# EAGLE design Ver.5 MAIN (EAGLE 9.6.2)
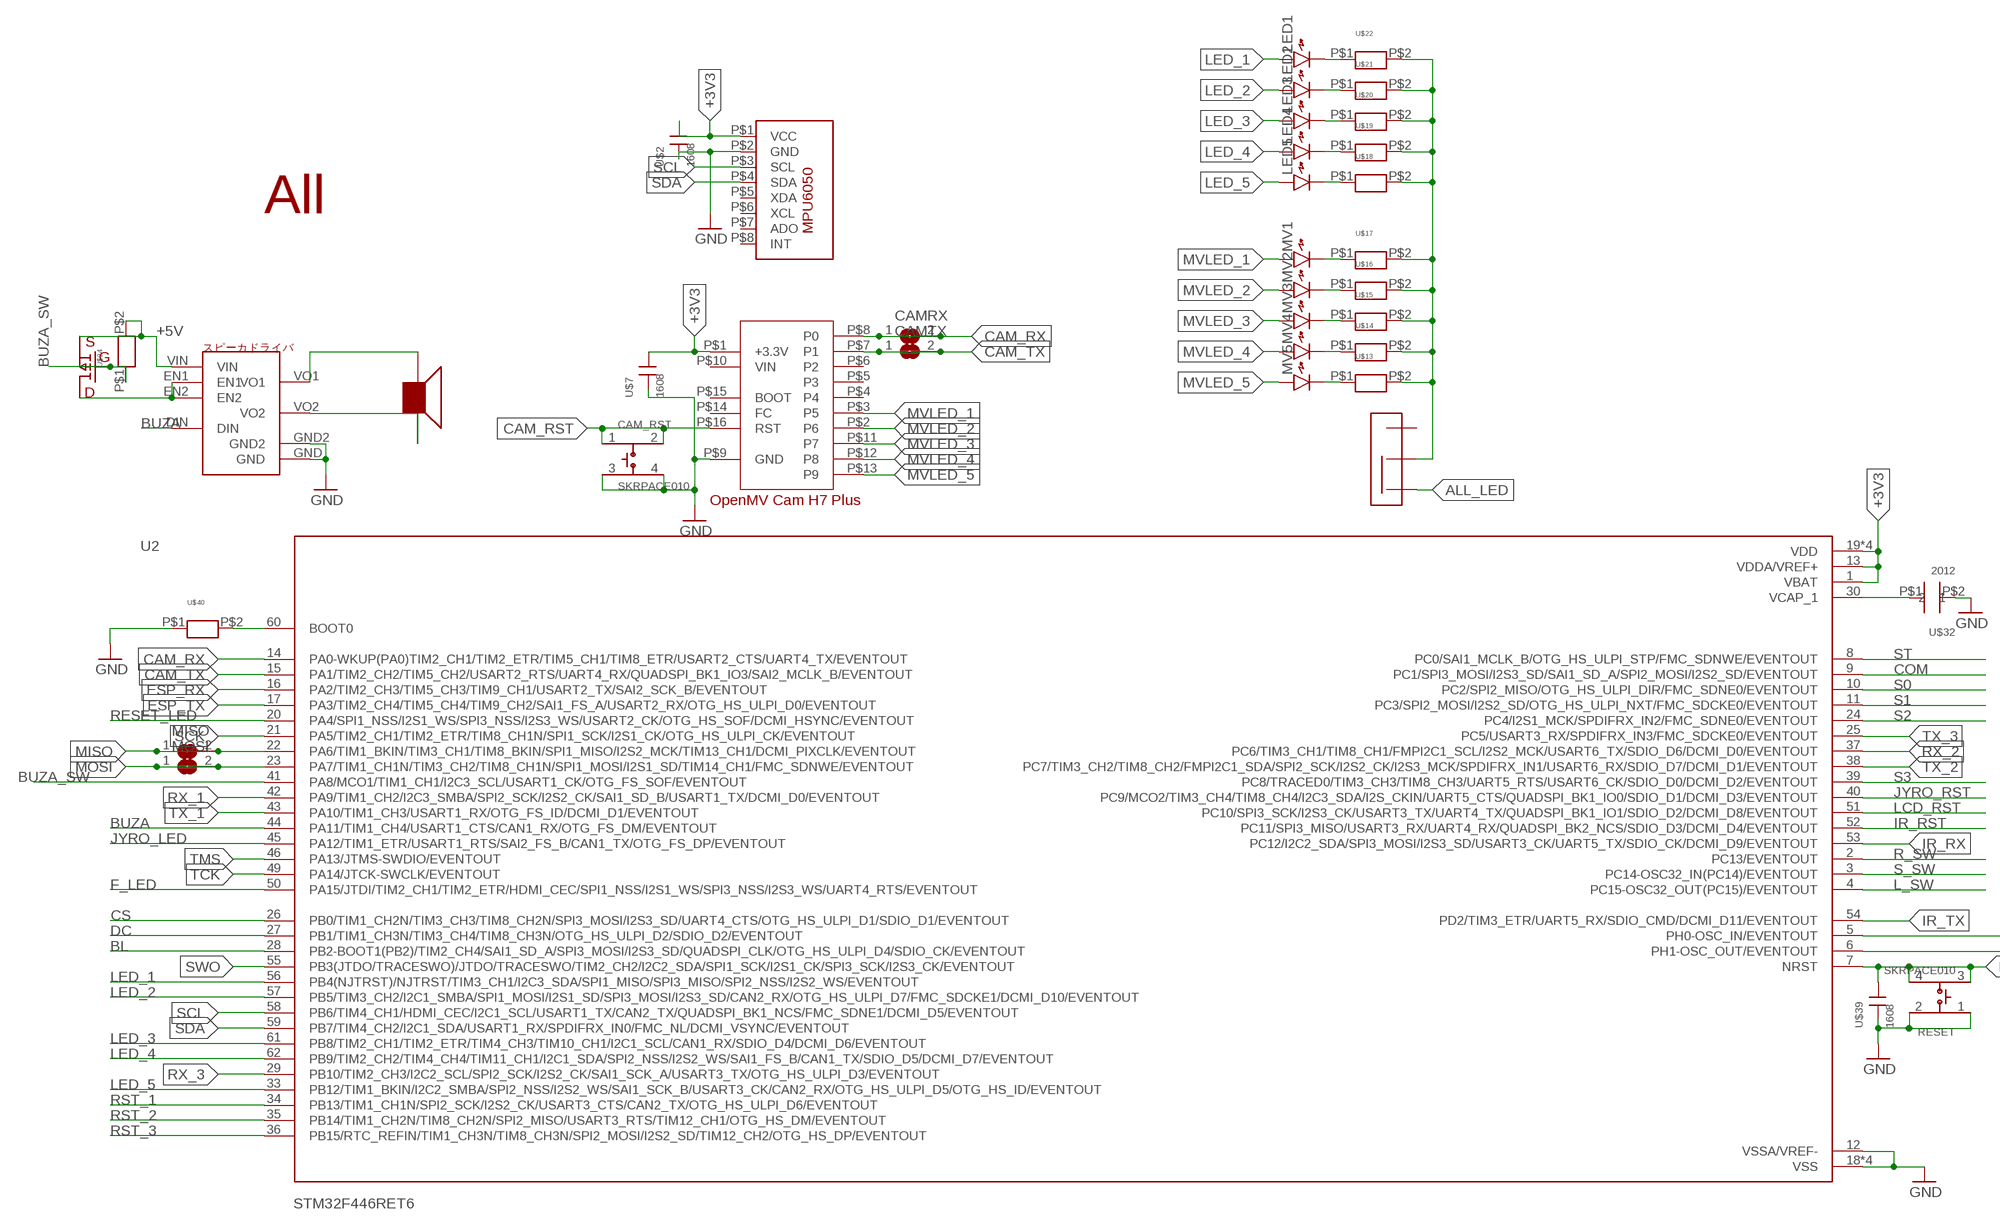
[diagram p0: schematic, sheet 1, part 1 of 2]
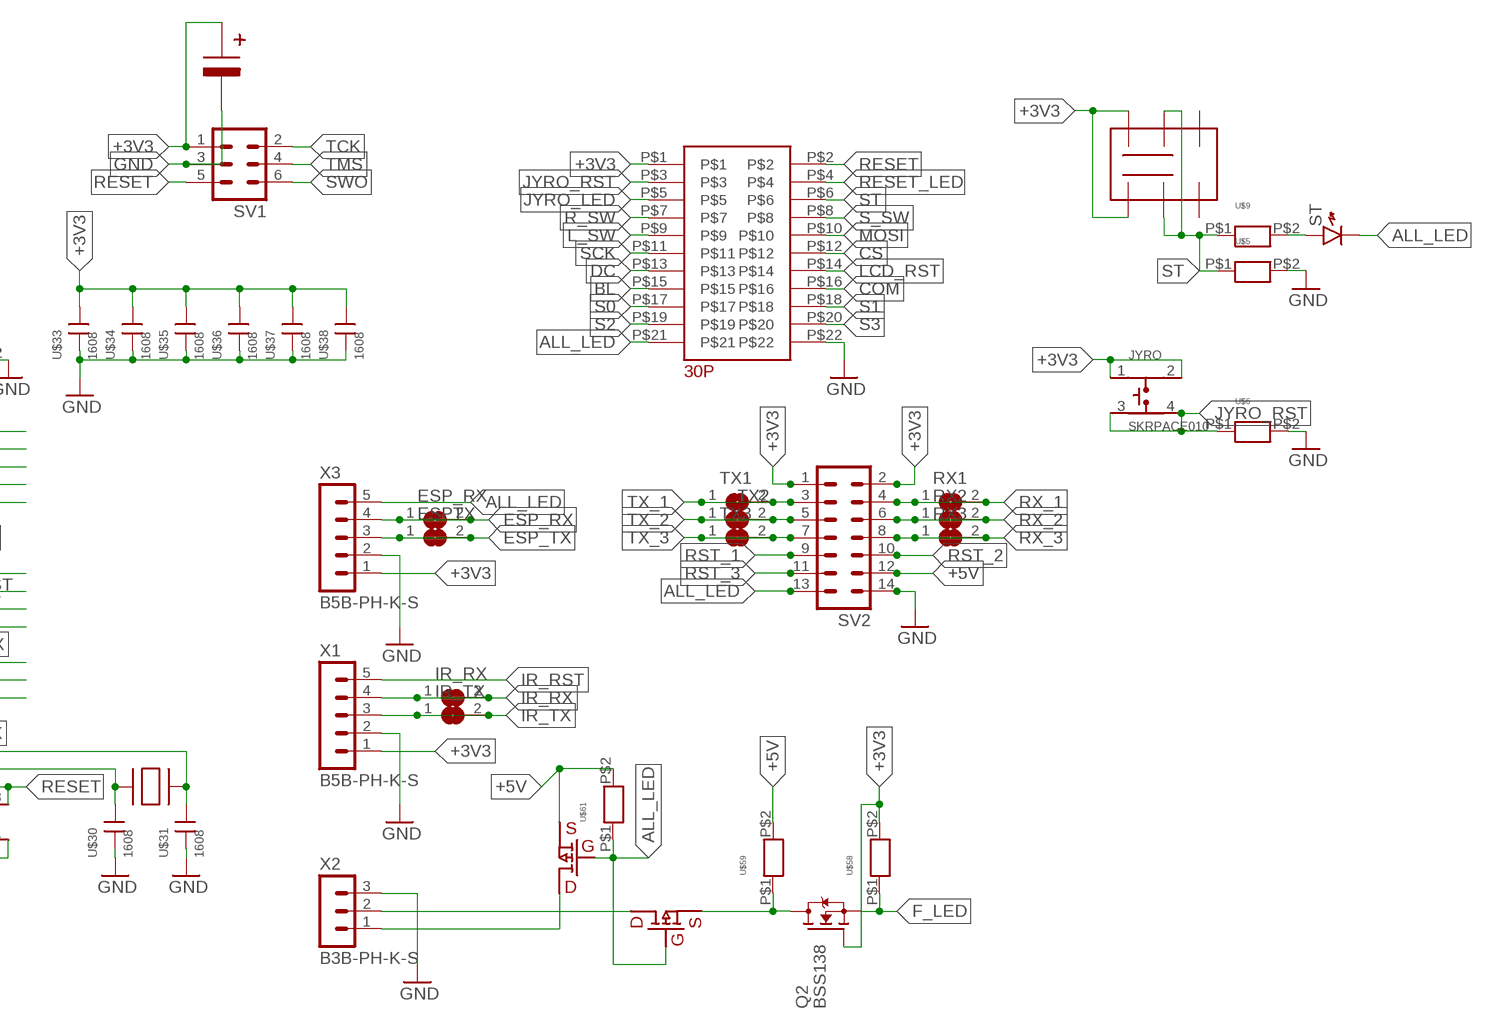
[diagram p1: schematic, sheet 1, part 2 of 2]

## Parts
CAM_RST  SKRPACE010  [SW_SKRPACE010]
CAMRX  SJ  [SJ]
CAMTX  SJ  [SJ]
ESP_RX  SJ  [SJ]
ESPTX  SJ  [SJ]
IR_RX  SJ  [SJ]
IR_TX  SJ  [SJ]
JYRO  SKRPACE010  [SW_SKRPACE010]
LED1  LED1608  [LED1608]
LED2  LED1608  [LED1608]
LED3  LED1608  [LED1608]
LED4  LED1608  [LED1608]
LED5  LED1608  [LED1608]
MISO  SJ  [SJ]
MOSI  SJ  [SJ]
MV1  LED1608  [LED1608]
MV2  LED1608  [LED1608]
MV3  LED1608  [LED1608]
MV4  LED1608  [LED1608]
MV5  LED1608  [LED1608]
Q2  BSS138  [SOT23]
RESET  SKRPACE010  [SW_SKRPACE010]
RX1  SJ  [SJ]
RX2  SJ  [SJ]
RX3  SJ  [SJ]
ST  LED1608  [LED1608]
SV1  ML6L  [ML6L]
SV2  ML14L  [ML14L]
TX1  SJ  [SJ]
TX2  SJ  [SJ]
TX3  SJ  [SJ]
U2  STM32F446RET6  [QFP50P1200X1200X160-64N]
U$1  OPENMV  [OPENMV]
U$2  1608  [CON]
U$3  ジャイロ  [ジャイロ]
U$4  LPRP  [LPRO]
U$5  R  [1608]
U$6  R  [1608]
U$7  1608  [CON]
U$8  22SW  [２２ｓｗ]
U$9  R  [1608]
U$10  SSW  [SSW]
U$11  BUZA_DR  [BUZA_DR]
U$12  BUZA-  [ぶざー]
U$13  R  [1608]
U$14  R  [1608]
U$15  R  [1608]
U$16  R  [1608]
U$17  R  [1608]
U$18  R  [1608]
U$19  R  [1608]
U$20  R  [1608]
U$21  R  [1608]
U$22  R  [1608]
U$23  808  [808]
U$24  R  [1608]
U$25  10  [10]
U$26  ALL  [ALL]
U$29  SUISYOU  [水晶]
U$30  1608  [CON]
U$31  1608  [CON]
U$32  2012  [2012]
U$33  1608  [CON]
U$34  1608  [CON]
U$35  1608  [CON]
U$36  1608  [CON]
U$37  1608  [CON]
U$38  1608  [CON]
U$39  1608  [CON]
U$40  R  [1608]
U$58  R  [1608]
U$59  R  [1608]
U$60  808  [808]
U$61  R  [1608]
U$62  808  [808]
X1  B5B-PH-K-S  [B5B-PH-K-S]
X2  B3B-PH-K-S  [B3B-PH-K-S]
X3  B5B-PH-K-S  [B5B-PH-K-S]

## Nets
+3V3 [New Class]: JYRO.1 JYRO.2 Q2.1(G) SV1.1 SV2.1 SV2.2 U2.1(VBAT) U2.13(VDDA/VREF+) U2.19(VDD) U2.32(VDD) U2.48(VDD) U2.64(VDD) U$1.P$1(+3.3V) U$2.P$1 U$3.P$1(VCC) U$4.P$1 U$7.P$1 U$8.P$1 U$8.P$4 U$25.P$1 U$33.P$1 U$34.P$1 U$35.P$1 U$36.P$1 U$37.P$1 U$38.P$1 U$58.P$2 X1.1 X3.1
+5V [New Class]: SV2.12 U$11.VIN U$23.S U$24.P$2 U$59.P$2 U$60.S U$61.P$2
+5V_OFF1 [New Class]: U$60.D U$60.DD(D) U$60.DDD(D) U$60.DDDD(D) X2.1
ALL_LED [New Class]: ST.K SV2.13 U$4.P$21 U$10.P$1 U$60.G U$61.P$1 U$62.G X3.5
BL: U2.28(PB2-BOOT1(PB2)/TIM2_CH4/SAI1_SD_A/SPI3_MOSI/I2S3_SD/QUADSPI_CLK/OTG_HS_ULPI_D4/SDIO_CK/EVENTOUT) U$4.P$15
BUZA: U2.44(PA11/TIM1_CH4/USART1_CTS/CAN1_RX/OTG_FS_DM/EVENTOUT) U$11.DIN
BUZA_SW: U2.41(PA8/MCO1/TIM1_CH1/I2C3_SCL/USART1_CK/OTG_FS_SOF/EVENTOUT) U$23.G U$24.P$1
CAM_RST: CAM_RST.1 CAM_RST.2 U$1.P$16(RST)
CAM_RX: CAMRX.1 CAMRX.2 U2.14(PA0-WKUP(PA0)TIM2_CH1/TIM2_ETR/TIM5_CH1/TIM8_ETR/USART2_CTS/UART4_TX/EVENTOUT) U$1.P$8(P0)
CAM_TX: CAMTX.1 CAMTX.2 U2.15(PA1/TIM2_CH2/TIM5_CH2/USART2_RTS/UART4_RX/QUADSPI_BK1_IO3/SAI2_MCLK_B/EVENTOUT) U$1.P$7(P1)
COM: U2.9(PC1/SPI3_MOSI/I2S3_SD/SAI1_SD_A/SPI2_MOSI/I2S2_SD/EVENTOUT) U$4.P$16
CS: U2.26(PB0/TIM1_CH2N/TIM3_CH3/TIM8_CH2N/SPI3_MOSI/I2S3_SD/UART4_CTS/OTG_HS_ULPI_D1/SDIO_D1/EVENTOUT) U$4.P$12
DC: U2.27(PB1/TIM1_CH3N/TIM3_CH4/TIM8_CH3N/OTG_HS_ULPI_D2/SDIO_D2/EVENTOUT) U$4.P$13
ESP_RX: ESP_RX.1 ESP_RX.2 U2.16(PA2/TIM2_CH3/TIM5_CH3/TIM9_CH1/USART2_TX/SAI2_SCK_B/EVENTOUT) X3.4
ESP_TX: ESPTX.1 ESPTX.2 U2.17(PA3/TIM2_CH4/TIM5_CH4/TIM9_CH2/SAI1_FS_A/USART2_RX/OTG_HS_ULPI_D0/EVENTOUT) X3.3
F_LED: Q2.2(S) U2.50(PA15/JTDI/TIM2_CH1/TIM2_ETR/HDMI_CEC/SPI1_NSS/I2S1_WS/SPI3_NSS/I2S3_WS/UART4_RTS/EVENTOUT) U$58.P$1
GND [New Class]: CAM_RST.3 CAM_RST.4 RESET.1 RESET.2 SV1.3 SV2.14 U2.12(VSSA/VREF-) U2.18(VSS) U2.31(VSS) U2.47(VSS) U2.63(VSS) U$1.P$9(GND) U$2.P$2 U$3.P$2(GND) U$4.P$22 U$5.P$2 U$6.P$2 U$7.P$2 U$11.GND U$11.GND2 U$25.P$2 U$30.P$2 U$31.P$2 U$32.P$2 U$33.P$2 U$34.P$2 U$35.P$2 U$36.P$2 U$37.P$2 U$38.P$2 U$39.P$2 U$40.P$1 X1.2 X2.3 X3.2
IR_RST: U2.52(PC11/SPI3_MISO/USART3_RX/UART4_RX/QUADSPI_BK2_NCS/SDIO_D3/DCMI_D4/EVENTOUT) X1.5
IR_RX: IR_RX.1 IR_RX.2 U2.53(PC12/I2C2_SDA/SPI3_MOSI/I2S3_SD/USART3_CK/UART5_TX/SDIO_CK/DCMI_D9/EVENTOUT) X1.4
IR_TX: IR_TX.1 IR_TX.2 U2.54(PD2/TIM3_ETR/UART5_RX/SDIO_CMD/DCMI_D11/EVENTOUT) X1.3
JYRO_LED: U2.45(PA12/TIM1_ETR/USART1_RTS/SAI2_FS_B/CAN1_TX/OTG_FS_DP/EVENTOUT) U$4.P$5
JYRO_RST: JYRO.3 JYRO.4 U2.40(PC9/MCO2/TIM3_CH4/TIM8_CH4/I2C3_SDA/I2S_CKIN/UART5_CTS/QUADSPI_BK1_IO0/SDIO_D1/DCMI_D3/EVENTOUT) U$4.P$3 U$6.P$1
L_SW: U2.4(PC15-OSC32_OUT(PC15)/EVENTOUT) U$4.P$9
LCD_RST: U2.51(PC10/SPI3_SCK/I2S3_CK/USART3_TX/UART4_TX/QUADSPI_BK1_IO1/SDIO_D2/DCMI_D8/EVENTOUT) U$4.P$14
LED_1: LED1.A U2.56(PB4(NJTRST)/NJTRST/TIM3_CH1/I2C3_SDA/SPI1_MISO/SPI3_MISO/SPI2_NSS/I2S2_WS/EVENTOUT)
LED_2: LED2.A U2.57(PB5/TIM3_CH2/I2C1_SMBA/SPI1_MOSI/I2S1_SD/SPI3_MOSI/I2S3_SD/CAN2_RX/OTG_HS_ULPI_D7/FMC_SDCKE1/DCMI_D10/EVENTOUT)
LED_3: LED3.A U2.61(PB8/TIM2_CH1/TIM2_ETR/TIM4_CH3/TIM10_CH1/I2C1_SCL/CAN1_RX/SDIO_D4/DCMI_D6/EVENTOUT)
LED_4: LED4.A U2.62(PB9/TIM2_CH2/TIM4_CH4/TIM11_CH1/I2C1_SDA/SPI2_NSS/I2S2_WS/SAI1_FS_B/CAN1_TX/SDIO_D5/DCMI_D7/EVENTOUT)
LED_5: LED5.A U2.33(PB12/TIM1_BKIN/I2C2_SMBA/SPI2_NSS/I2S2_WS/SAI1_SCK_B/USART3_CK/CAN2_RX/OTG_HS_ULPI_D5/OTG_HS_ID/EVENTOUT)
MISO: MISO.1 MISO.2 U2.22(PA6/TIM1_BKIN/TIM3_CH1/TIM8_BKIN/SPI1_MISO/I2S2_MCK/TIM13_CH1/DCMI_PIXCLK/EVENTOUT)
MOSI: MOSI.1 MOSI.2 U2.23(PA7/TIM1_CH1N/TIM3_CH2/TIM8_CH1N/SPI1_MOSI/I2S1_SD/TIM14_CH1/FMC_SDNWE/EVENTOUT) U$4.P$10
MVLED_1: MV1.A U$1.P$3(P5)
MVLED_2: MV2.A U$1.P$2(P6)
MVLED_3: MV3.A U$1.P$11(P7)
MVLED_4: MV4.A U$1.P$12(P8)
MVLED_5: MV5.A U$1.P$13(P9)
N$1: U$62.D U$62.DD(D) U$62.DDD(D) U$62.DDDD(D) X2.2
N$2: U$11.VO1 U$12.P$1
N$3: U$11.VO2 U$12.P$2
N$6: U$11.EN1 U$11.EN2 U$23.D U$23.DD(D) U$23.DDD(D) U$23.DDDD(D)
N$17: ST.A U$9.P$2
N$19: U$10.P$3 U$13.P$2 U$14.P$2 U$15.P$2 U$16.P$2 U$17.P$2 U$18.P$2 U$19.P$2 U$20.P$2 U$21.P$2 U$22.P$2
N$20: LED1.K U$22.P$1
N$21: LED2.K U$21.P$1
N$22: LED3.K U$20.P$1
N$23: LED4.K U$19.P$1
N$24: LED5.K U$18.P$1
N$25: MV5.K U$13.P$1
N$26: MV4.K U$14.P$1
N$27: MV3.K U$15.P$1
N$28: MV2.K U$16.P$1
N$29: MV1.K U$17.P$1
N$40: U2.6(PH1-OSC_OUT/EVENTOUT) U$29.P$1 U$30.P$1
N$41: U2.5(PH0-OSC_IN/EVENTOUT) U$29.P$2 U$31.P$1
N$42: Q2.3(D) U$59.P$1 U$62.S
N$43: U2.30(VCAP_1) U$32.P$1
N$44: U2.60(BOOT0) U$40.P$2
R_SW: U2.2(PC13/EVENTOUT) U$4.P$7
RESET: RESET.3 RESET.4 SV1.5 U2.7(NRST) U$4.P$2 U$39.P$1
RESET_LED: U2.20(PA4/SPI1_NSS/I2S1_WS/SPI3_NSS/I2S3_WS/USART2_CK/OTG_HS_SOF/DCMI_HSYNC/EVENTOUT) U$4.P$4
RST_1: SV2.9 U2.34(PB13/TIM1_CH1N/SPI2_SCK/I2S2_CK/USART3_CTS/CAN2_TX/OTG_HS_ULPI_D6/EVENTOUT)
RST_2: SV2.10 U2.35(PB14/TIM1_CH2N/TIM8_CH2N/SPI2_MISO/USART3_RTS/TIM12_CH1/OTG_HS_DM/EVENTOUT)
RST_3: SV2.11 U2.36(PB15/RTC_REFIN/TIM1_CH3N/TIM8_CH3N/SPI2_MOSI/I2S2_SD/TIM12_CH2/OTG_HS_DP/EVENTOUT)
RX_1: RX1.1 RX1.2 SV2.4 U2.42(PA9/TIM1_CH2/I2C3_SMBA/SPI2_SCK/I2S2_CK/SAI1_SD_B/USART1_TX/DCMI_D0/EVENTOUT)
RX_2: RX2.1 RX2.2 SV2.6 U2.37(PC6/TIM3_CH1/TIM8_CH1/FMPI2C1_SCL/I2S2_MCK/USART6_TX/SDIO_D6/DCMI_D0/EVENTOUT)
RX_3: RX3.1 RX3.2 SV2.8 U2.29(PB10/TIM2_CH3/I2C2_SCL/SPI2_SCK/I2S2_CK/SAI1_SCK_A/USART3_TX/OTG_HS_ULPI_D3/EVENTOUT)
S0: U2.10(PC2/SPI2_MISO/OTG_HS_ULPI_DIR/FMC_SDNE0/EVENTOUT) U$4.P$17
S1: U2.11(PC3/SPI2_MOSI/I2S2_SD/OTG_HS_ULPI_NXT/FMC_SDCKE0/EVENTOUT) U$4.P$18
S2: U2.24(PC4/I2S1_MCK/SPDIFRX_IN2/FMC_SDNE0/EVENTOUT) U$4.P$19
S3: U2.39(PC8/TRACED0/TIM3_CH3/TIM8_CH3/UART5_RTS/USART6_CK/SDIO_D0/DCMI_D2/EVENTOUT) U$4.P$20
S_SW: U2.3(PC14-OSC32_IN(PC14)/EVENTOUT) U$4.P$8
SCK: U2.21(PA5/TIM2_CH1/TIM2_ETR/TIM8_CH1N/SPI1_SCK/I2S1_CK/OTG_HS_ULPI_CK/EVENTOUT) U$4.P$11
SCL: U2.58(PB6/TIM4_CH1/HDMI_CEC/I2C1_SCL/USART1_TX/CAN2_TX/QUADSPI_BK1_NCS/FMC_SDNE1/DCMI_D5/EVENTOUT) U$3.P$3(SCL)
SDA: U2.59(PB7/TIM4_CH2/I2C1_SDA/USART1_RX/SPDIFRX_IN0/FMC_NL/DCMI_VSYNC/EVENTOUT) U$3.P$4(SDA)
ST: U2.8(PC0/SAI1_MCLK_B/OTG_HS_ULPI_STP/FMC_SDNWE/EVENTOUT) U$4.P$6 U$5.P$1 U$8.P$2 U$8.P$5 U$9.P$1
SWO: SV1.6 U2.55(PB3(JTDO/TRACESWO)/JTDO/TRACESWO/TIM2_CH2/I2C2_SDA/SPI1_SCK/I2S1_CK/SPI3_SCK/I2S3_CK/EVENTOUT)
TCK: SV1.2 U2.49(PA14/JTCK-SWCLK/EVENTOUT)
TMS: SV1.4 U2.46(PA13/JTMS-SWDIO/EVENTOUT)
TX_1: SV2.3 TX1.1 TX1.2 U2.43(PA10/TIM1_CH3/USART1_RX/OTG_FS_ID/DCMI_D1/EVENTOUT)
TX_2: SV2.5 TX2.1 TX2.2 U2.38(PC7/TIM3_CH2/TIM8_CH2/FMPI2C1_SDA/SPI2_SCK/I2S2_CK/I2S3_MCK/SPDIFRX_IN1/USART6_RX/SDIO_D7/DCMI_D1/EVENTOUT)
TX_3: SV2.7 TX3.1 TX3.2 U2.25(PC5/USART3_RX/SPDIFRX_IN3/FMC_SDCKE0/EVENTOUT)
Unconnected: U$1.P$4(P4) U$1.P$5(P3) U$1.P$6(P2) U$1.P$10(VIN) U$1.P$14(FC) U$1.P$15(BOOT) U$3.P$5(XDA) U$3.P$6(XCL) U$3.P$7(ADO) U$3.P$8(INT) U$8.P$3 U$8.P$6 U$10.P$2

## Library data of the parts
CAM_RST JYRO RESET = SKRPACE010:SKRPACE010: Switch Tactile N.O. SPST Button J-Bend 0.05A 16VDC 2.55N SMD Automotive T/R Check prices <https://pricing.snapeda.com/parts/SKRPACE010/ALPS/view-part?ref=eda>; AVAILABILITY: In Stock; DESCRIPTION: Switch Tactile N.O. SPST Button J-Bend 0.05A 16VDC 2.55N SMD Automotive T/R; MF: ALPS; MP: SKRPACE010; PACKAGE: None; PRICE: None
CAMRX CAMTX ESP_RX ESPTX IR_RX IR_TX MISO MOSI RX1-RX3 TX1-TX3 = jumper:SJ: SMD solder JUMPER
LED1-LED5 MV1-MV5 ST = generic:LED: Generic LEDs
Q2 = bss138_10:BSS138: BSS138 N-Channel Logic Level Enhancement Mode Field Effect Transistor Source: http://www.fairchildsemi.com/datasheets/BS/BSS138.pdf; MF: Fairchild; MPN: BSS138; OC_FARNELL: 9845330; OC_NEWARK: 67R2009
SV1 = con-ml:ML6L: HARTING; OC_FARNELL: unknown; OC_NEWARK: unknown
SV2 = con-ml:ML14L: HARTING; OC_FARNELL: unknown; OC_NEWARK: unknown
U2 = STM32F446RET6:STM32F446RET6: MCU 32-Bit STM32 ARM Cortex M4 RISC 512KB Flash 2.5V/3.3V 64-Pin LQFP Tray Check availability <https://pricing.snapeda.com/parts/STM32F446RET6/STMicroelectronics/view-part?ref=eda>; AVAILABILITY: In Stock; DESCRIPTION: ARM® Cortex®-M4 STM32F4 Microcontroller IC 32-Bit 180MHz 512KB (512K x 8) FLASH 64-LQFP (10x10); MF: STMicroelectronics; MP: STM32F446RET6; PACKAGE: LQFP-64 STMicroelectronics; PRICE: None; PURCHASE-URL: https://pricing.snapeda.com/search/part/STM32F446RET6/?ref=eda
U$1 = OPENMV:OPENMV
U$2 U$7 U$30 U$31 U$33-U$39 = con1608:1608
U$3 = ジャイロセンサ:ジャイロ
U$4 = 22Ｐ　ロープロ:LPRP
U$5 U$6 U$9 U$13-U$22 U$24 U$40 U$58 U$59 U$61 = R 1608:R
U$8 = 2回路SW:22SW
U$10 = SSW:SSW
U$11 = ブザードライバ:BUZA_DR
U$12 = ブザー:BUZA-
U$23 U$60 U$62 = PchMOSFET SSM6J808R:808
U$25 = 10uF50V 電解:10
U$26 = All_outlook:ALL
U$29 = 水晶:SUISYOU
U$32 = C2012:2012
X1 X3 = con-JST PH:B5B-PH: JST PH series header 2.00mm pitch disconnectable crimp style connectors, vertical (side entry type), 5 pins
X2 = con-JST PH:B3B-PH: JST PH series header 2.00mm pitch disconnectable crimp style connectors, vertical (side entry type), 3 pins

## Net classes
1 New Class: width 0.254 mm

## Board
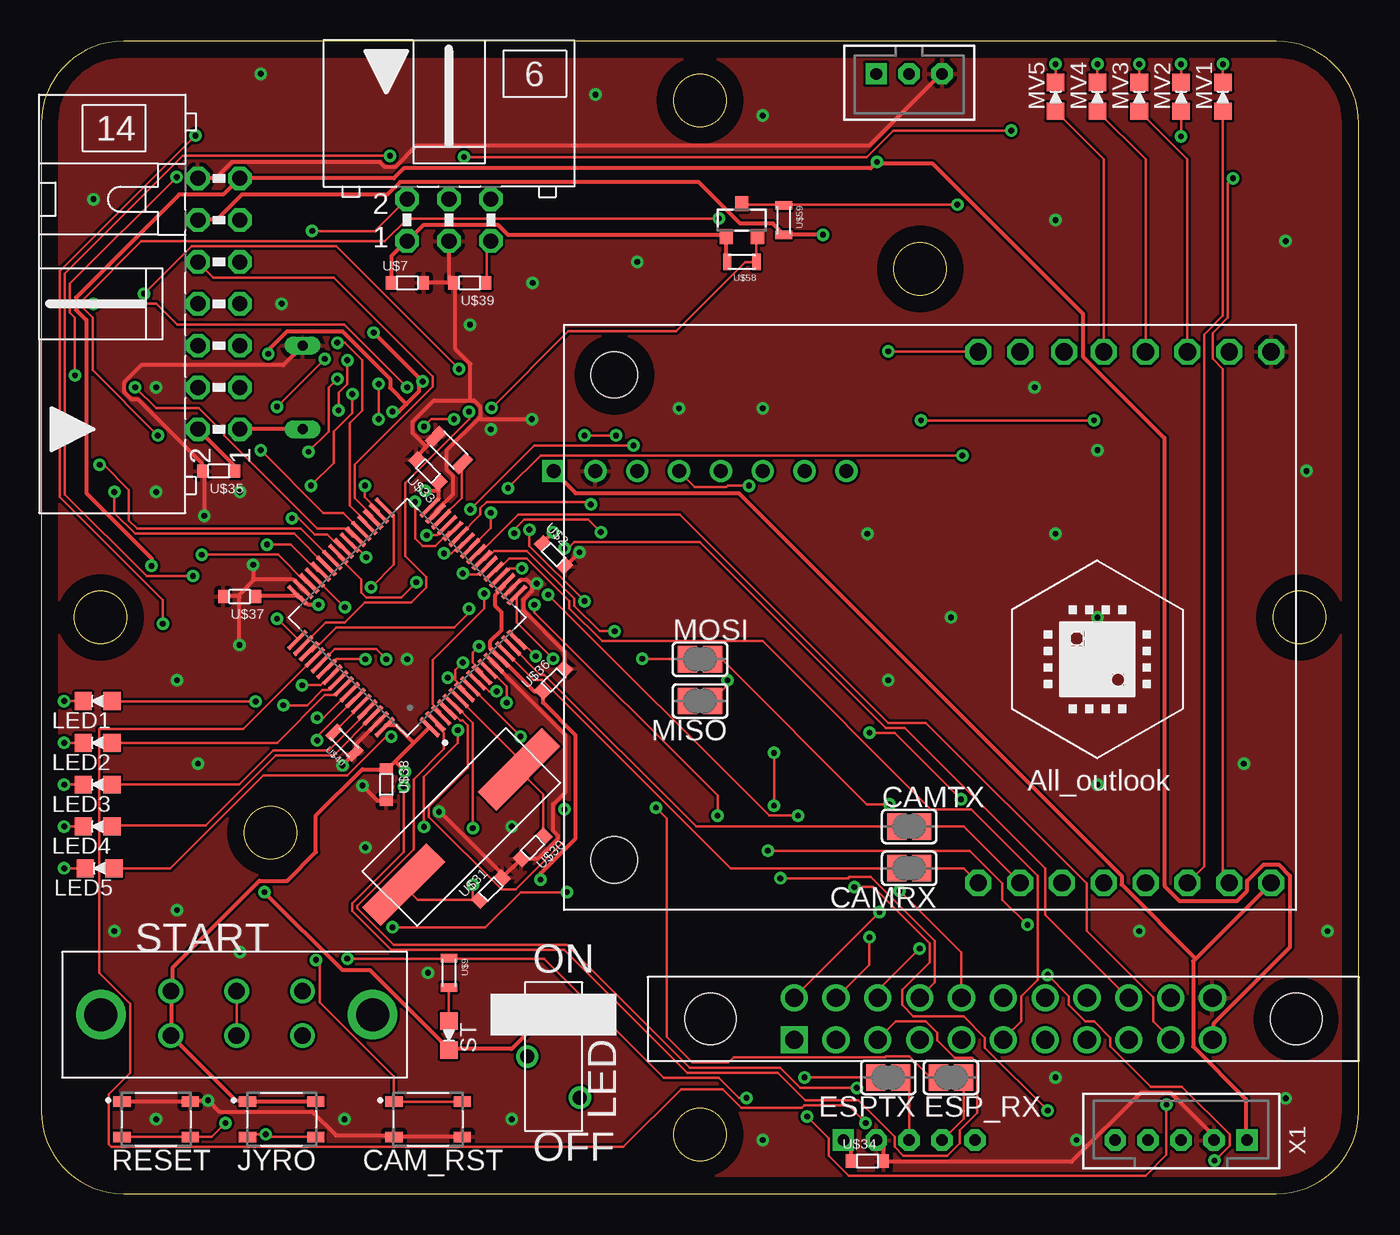
[diagram p2: board, top side]
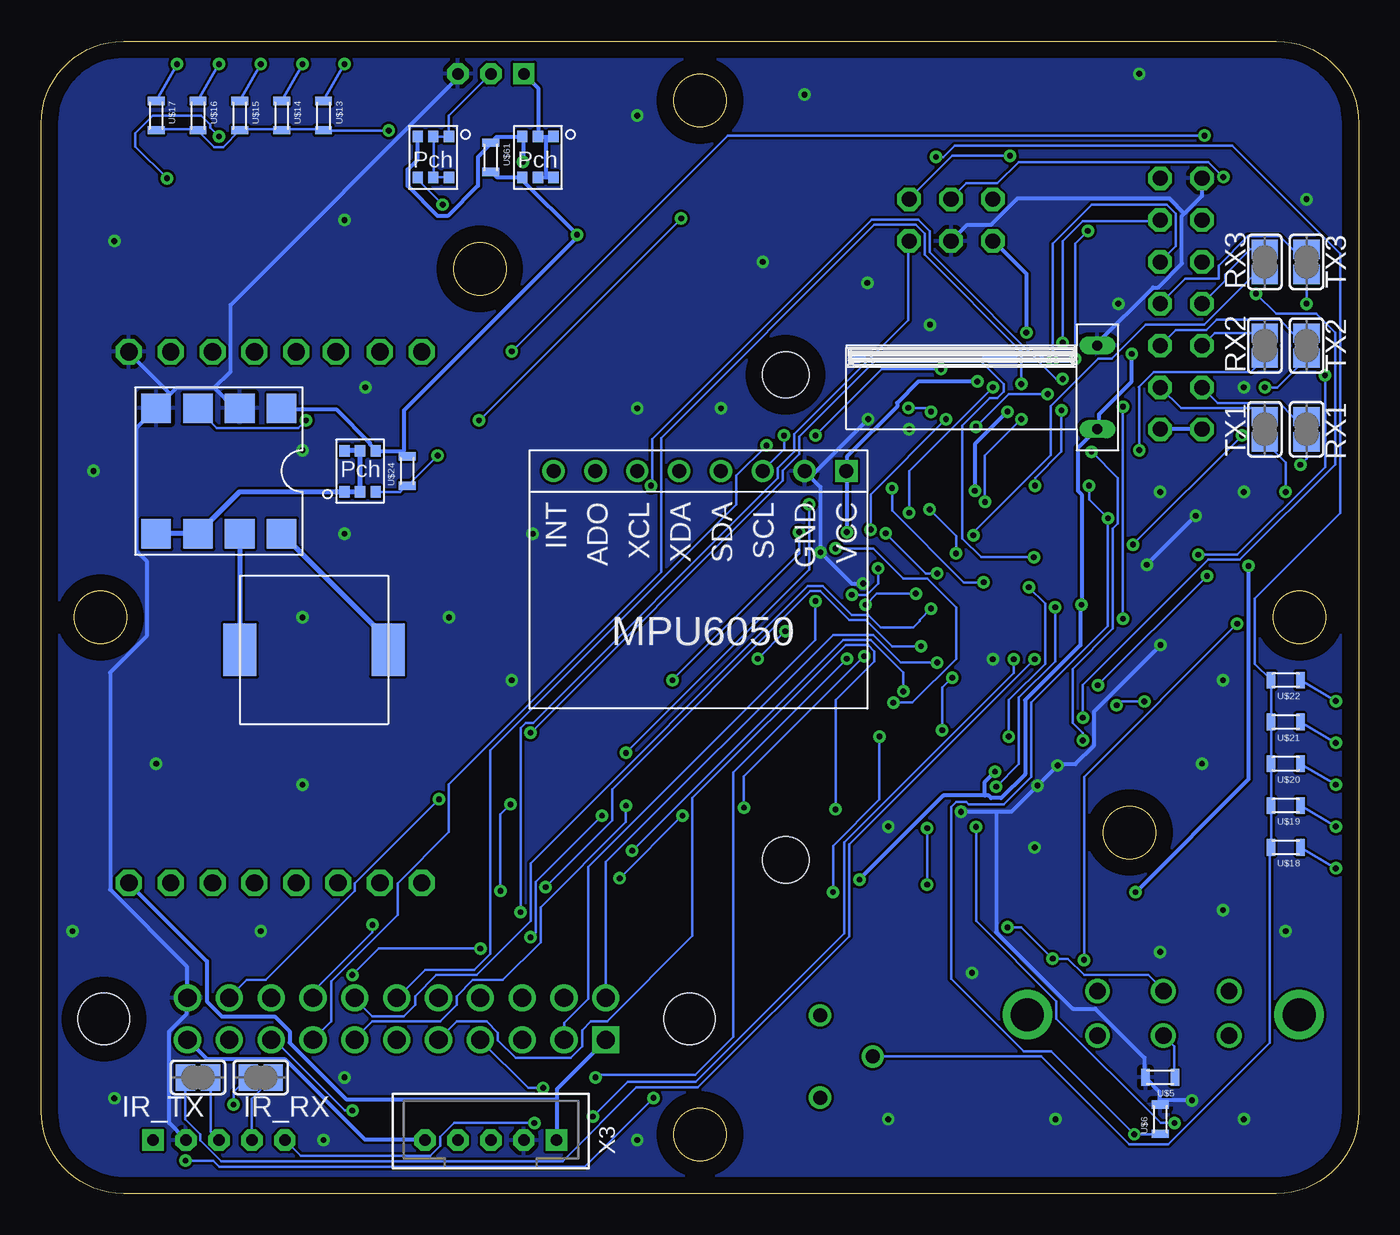
[diagram p3: board, bottom side, seen from below]

Size 80 x 70 mm. Coordinates in mm from the lower left corner, seen from the top.
Outline: 5,0 75,0 arc90 80,5 80,65 arc90 75,70 5,70 arc90 0,65 0,5 arc90 5,0
Outline: circle at 3.6,35 radius 1.6
Outline: circle at 40,3.6 radius 1.6
Outline: circle at 76.4,35 radius 1.6
Outline: circle at 40,66.4 radius 1.6
Outline: circle at 3.6,35 radius 1.6
Outline: circle at 40,3.6 radius 1.6
Outline: circle at 40,66.4 radius 1.6
Outline: circle at 76.4,35 radius 1.6
Outline: circle at 13.92,21.93 radius 1.6
Outline: circle at 53.37,56.17 radius 1.6
Copper layers (1*16): Top 0.035mm / dielectric 1.5mm / Bottom 0.035mm
Design rules "default": minimum track width 6mil, minimum drill 0.35mm, track to track 6mil, track to pad 6mil, pad to pad 6mil, via to via 6mil, smd to smd 6mil, copper to edge 40mil, drill to drill 6mil, minimum pad ring 10mil, minimum via ring 8mil, stop-mask expansion 4mil, vias tented up to drill 0mil, thermal gap 10mil

### Footprints (pad centres in the part's own frame; a part is rotated, then mirrored left to right if it is on the bottom)
SW_SKRPACE010 = smd 1.05 x 0.65: 1 -2.075,1.075; 2 2.075,1.075; 3 -2.075,-1.075; 4 2.075,-1.075
SJ = smd 1.168 x 1.6: 1 -0.762,0; 2 0.762,0
LED1608 = smd 1.05 x 1.08: A -0.875,0; K 0.875,0
SOT23 = smd 0.8 x 0.9: 1 -0.95,-1; 2 0.95,-1; 3 0,1
ML6L = drill 0.914 octagon: 1 -2.54,-1.27; 2 -2.54,1.27; 3 0,-1.27; 4 0,1.27; 5 2.54,-1.27; 6 2.54,1.27
ML14L = drill 0.914 octagon: 1 -7.62,-1.27; 2 -7.62,1.27; 3 -5.08,-1.27; 4 -5.08,1.27; 5 -2.54,-1.27; 6 -2.54,1.27; 7 0,-1.27; 8 0,1.27; 9 2.54,-1.27; 10 2.54,1.27; 11 5.08,-1.27; 12 5.08,1.27; 13 7.62,-1.27; 14 7.62,1.27
QFP50P1200X1200X160-64N = smd 1.56 x 0.28: 1 -5.68,3.75; 2 -5.68,3.25; 3 -5.68,2.75; 4 -5.68,2.25; 5 -5.68,1.75; 6 -5.68,1.25; 7 -5.68,0.75; 8 -5.68,0.25; 9 -5.68,-0.25; 10 -5.68,-0.75; 11 -5.68,-1.25; 12 -5.68,-1.75; 13 -5.68,-2.25; 14 -5.68,-2.75; 15 -5.68,-3.25; 16 -5.68,-3.75; 33 5.68,-3.75; 34 5.68,-3.25; 35 5.68,-2.75; 36 5.68,-2.25; 37 5.68,-1.75; 38 5.68,-1.25; 39 5.68,-0.75; 40 5.68,-0.25; 41 5.68,0.25; 42 5.68,0.75; 43 5.68,1.25; 44 5.68,1.75; 45 5.68,2.25; 46 5.68,2.75; 47 5.68,3.25; 48 5.68,3.75 | smd 0.28 x 1.56: 17 -3.75,-5.68; 18 -3.25,-5.68; 19 -2.75,-5.68; 20 -2.25,-5.68; 21 -1.75,-5.68; 22 -1.25,-5.68; 23 -0.75,-5.68; 24 -0.25,-5.68; 25 0.25,-5.68; 26 0.75,-5.68; 27 1.25,-5.68; 28 1.75,-5.68; 29 2.25,-5.68; 30 2.75,-5.68; 31 3.25,-5.68; 32 3.75,-5.68; 49 3.75,5.68; 50 3.25,5.68; 51 2.75,5.68; 52 2.25,5.68; 53 1.75,5.68; 54 1.25,5.68; 55 0.75,5.68; 56 0.25,5.68; 57 -0.25,5.68; 58 -0.75,5.68; 59 -1.25,5.68; 60 -1.75,5.68; 61 -2.25,5.68; 62 -2.75,5.68; 63 -3.25,5.68; 64 -3.75,5.68
OPENMV = drill 1.05 octagon: P$1 1.651,1.524; P$2 1.651,4.064; P$3 1.651,6.604; P$4 1.651,9.144; P$5 1.651,11.684; P$6 1.651,14.224; P$7 1.651,16.764; P$8 1.651,19.304; P$9 33.909,1.524; P$10 33.909,4.064; P$11 33.909,6.604; P$12 33.909,9.144; P$13 33.909,11.684; P$14 33.909,14.097; P$15 33.909,16.764; P$16 33.909,19.304 | hole 2.794: 32.512,41.402; 3.048,41.402
CON = smd 0.6 x 0.813: P$1 -1,0; P$2 1,0
ジャイロ = drill 0.85 square: P$1 1.27,1.27 | drill 0.85: P$2 3.81,1.27; P$3 6.35,1.27; P$4 8.89,1.27; P$5 11.43,1.27; P$6 13.97,1.27; P$7 16.51,1.27; P$8 19.05,1.27
LPRO = drill 1.1 square: P$1 0,29.21 | drill 1.1: P$2 2.54,29.21; P$3 0,26.67; P$4 2.54,26.67; P$5 0,24.13; P$6 2.54,24.13; P$7 0,21.59; P$8 2.54,21.59; P$9 0,19.05; P$10 2.54,19.05; P$11 0,16.51; P$12 2.54,16.51; P$13 0,13.97; P$14 2.54,13.97; P$15 0,11.43; P$16 2.54,11.43; P$17 0,8.89; P$18 2.54,8.89; P$19 0,6.35; P$20 2.54,6.35; P$21 0,3.81; P$22 2.54,3.81 | hole 3.1: 1.27,-1.27; 1.27,34.29
1608 = smd 0.508 x 1.016: P$1 -0.889,0; P$2 0.889,0
２２ｓｗ = drill 1: P$1 0,8; P$2 0,4; P$3 0,0; P$4 2.7,8; P$5 2.7,4; P$6 2.7,0 | drill 2: P$7 1.27,-4.25; P$8 1.27,12.25
SSW = drill 0.85: P$1 -2.5,1.6; P$2 2.5,1.6; P$3 0,-1.6
BUZA_DR = smd 1.8 x 1.8: DIN 5.08,0; EN1 5.08,7.62; EN2 7.62,7.62; GND 2.54,0; GND2 7.62,0; VIN 0,0; VO1 0,7.62; VO2 2.54,7.62
ぶざー = smd 3.2 x 2: P$1 4.5,9; P$2 4.5,0
808 = smd 0.62 x 0.7: D 0,0; DD 0.95,0; DDD 0.95,2.5; DDDD 0,2.5; G 1.9,0; S 1.9,2.5
10 = drill 0.6 long: P$1 -1.27,-1.27; P$2 3.81,-1.27
水晶 = smd 5.5 x 1.6: P$1 1.2,2.35; P$2 11.1,2.35
2012 = smd 0.635 x 1.27: P$1 -1.143,0; P$2 1.143,0
B5B-PH-K-S = drill 0.7 pad 1.3 square: 1 4,0 | drill 0.7 pad 1.3 octagon: 2 2,0; 3 0,0; 4 -2,0; 5 -4,0
B3B-PH-K-S = drill 0.7 pad 1.3 square: 1 2,0 | drill 0.7 pad 1.3 octagon: 2 0,0; 3 -2,0

### Placement (x,y rotation side)
CAM_RST  23.49,4.52 0 top
CAMRX  52.7,19.76 180 top
CAMTX  52.7,22.3 0 top
ESP_RX  55.24,7.06 180 top
ESPTX  51.43,7.06 180 top
IR_RX  66.67,7.06 180 bottom
IR_TX  70.48,7.06 180 bottom
JYRO  14.6,4.52 0 top
LED1  3.42,29.92 180 top
LED2  3.42,27.38 180 top
LED3  3.42,24.84 180 top
LED4  3.42,22.3 180 top
LED5  3.55,19.76 180 top
MISO  40,29.92 180 top
MOSI  40,32.46 0 top
MV1  71.75,66.62 90 top
MV2  69.21,66.62 90 top
MV3  66.67,66.62 90 top
MV4  64.13,66.62 90 top
MV5  61.59,66.62 90 top
Q2  42.54,59.13 0 top
RESET  6.98,4.52 0 top
RX1  3.17,46.43 270 bottom
RX2  5.71,51.51 90 bottom
RX3  5.71,56.59 90 bottom
ST  24.76,9.6 270 top
SV1  24.76,59.13 0 top
SV2  10.79,54.05 90 top
TX1  5.71,46.43 90 bottom
TX2  3.17,51.51 270 bottom
TX3  3.17,56.59 270 bottom
U2  22.22,35 135 top
U$1  76.2,17.22 90 top
U$2  31.11,38.81 315 top
U$3  29.84,45.16 180 bottom
U$4  74.92,9.35 90 top
U$5  12.06,7.06 180 bottom
U$6  12.06,4.52 90 bottom
U$7  22.22,55.32 0 top
U$8  15.87,9.6 90 top
U$9  24.76,13.41 270 top
U$10  31.11,8.33 270 top
U$11  65.4,47.7 180 bottom
U$12  67.94,37.54 270 bottom
U$13  62.86,65.48 270 bottom
U$14  65.4,65.48 270 bottom
U$15  67.94,65.48 270 bottom
U$16  70.48,65.48 270 bottom
U$17  73.02,65.48 270 bottom
U$18  4.44,21.03 180 bottom
U$19  4.44,23.57 180 bottom
U$20  4.44,26.11 180 bottom
U$21  4.44,28.65 180 bottom
U$22  4.44,31.19 180 bottom
U$23  61.59,42.62 0 bottom
U$24  57.78,43.89 90 bottom
U$25  17.14,47.7 90 bottom
U$26  64.13,32.46 0 top
U$29  28.2,28.28 225 top
U$30  29.84,21.03 225 top
U$31  27.3,18.49 45 top
U$32  24.76,45.16 135 top
U$33  23.49,43.89 135 top
U$34  50.16,1.98 0 top
U$35  10.79,43.89 180 top
U$36  31.11,31.19 45 top
U$37  12.06,36.27 180 top
U$38  20.95,24.84 270 top
U$39  26.03,55.32 180 top
U$40  18.41,27.38 135 top
U$58  42.54,56.59 180 top
U$59  45.08,59.13 270 top
U$60  48.89,64.21 180 bottom
U$61  52.7,62.94 270 bottom
U$62  55.24,64.21 180 bottom
X1  69.21,3.25 0 top
X2  52.7,68.02 180 top
X3  52.7,3.25 0 bottom

### Tracks (layer width: path | path; a pad name or v marks a point on that pad's centre or on a via)
+3V3  (via drill 0.35)
  Top 0.254: U$34.P$1 49.14,2.01 49.14,2.84 48.76,3.23 X3.1 | 70.1,14.27 74.67,18.85 U$1.P$1 | 70.1,14.27 69.95,14.12 69.95,8.94 73.15,5.74 73.15,3.3 X1.1 | 22.63,27.38 23.54,28.29 U2.1 | 22.63,27.38 21.48,26.24 | 21.48,26.24 21.1,25.86 20.95,25.86 U$38.P$1 20.87,25.78 19.5,25.78 16.68,22.96 16.68,20.75 14.93,19 13.25,19 8,13.74 8,12.37 U$8.P$4 7.92,12.29 7.92,9.7 U$8.P$1 7.92,9.55 11.81,5.66 12.42,5.66 JYRO.1 12.57,5.59 16.61,5.59 JYRO.2 | 22.63,27.38 21.56,28.45 20.95,28.45 20.87,28.37 U2.64 | v31.09,40.18 30.48,39.57 U$2.P$1 | 24.15,42.7 24.15,42.24 23.62,41.71 U2.32 | 24.15,42.7 24.15,43.15 U$33.P$1 | U$58.P$2 41.6,56.64 41.6,58.09 Q2.1 41.52,58.24 28.34,58.24 27.73,58.85 23.24,58.85 22.32,57.94 SV1.1 22.17,57.86 21.25,56.95 21.25,55.34 U$7.P$1 | v23.31,42.7 24.15,42.7 | v21.33,47.5 21.71,47.5 22.17,47.95 | 22.17,47.95 22.93,48.72 22.93,49.33 | 22.93,49.33 22.93,49.55 v20.19,52.3 | 22.93,49.33 v23.16,49.33 | U2.19 28.11,37.06 28.11,36.91 27.58,36.37 27.58,35.69 27.96,35.3 27.96,34.24 27.27,33.55 27.27,33.09 27.73,32.64 U2.13 27.88,32.56 29.94,30.5 30.4,30.5 U$36.P$1 30.48,30.43 30.48,29.82 32.46,27.84 32.46,21.59 30.32,19.45 v30.32,19.07 | SV2.2 11.73,44.22 11.73,43.91 U$35.P$1 | U$37.P$1 13.1,36.3 15.54,36.3 U2.48 15.62,36.22 15.77,36.22 16.23,35.76 v16.84,35.76 | U$25.P$1 SV2.1 | 22.17,47.95 21.18,48.95 21.18,49.48 18.28,52.37 14.93,52.37 13.79,51.23 v13.79,51 | v22.09,25.63 21.48,26.24 | 70.1,14.27 65.6,18.77 65.6,19.3 42.36,42.54 32.46,42.54 U$3.P$1
  Bottom 0.254: 48.69,5.74 48.69,6.35 45.72,9.32 U$4.P$1 | 48.69,5.74 48.69,3.3 X3.1 | 48.69,5.74 61.49,5.74 64.92,9.17 64.92,9.85 65.83,10.77 69.03,10.77 69.95,11.68 69.95,14.12 74.67,18.85 U$1.P$1 | v31.09,40.18 31.09,43.84 U$3.P$1 31.09,43.99 31.09,44.75 28.04,47.8 28.04,48.03 26.74,49.33 v23.16,49.33 | v23.31,42.7 23.31,45.52 v21.33,47.5 | v20.19,52.3 20.19,55.88 22.17,57.86 SV1.1 | SV2.2 SV2.1 | v30.32,19.07 25.22,24.18 22.7,24.18 | 22.7,24.18 22.47,24.18 22.32,24.03 21.71,24.03 20.26,25.48 20.26,29.97 16.91,33.32 16.91,35.69 v16.84,35.76 16.84,42.47 17.06,42.7 17.06,45.29 15.92,46.43 U$25.P$1 15.77,46.51 15.77,47.34 13.79,49.33 v13.79,51 | v22.09,25.63 22.7,25.02 22.7,24.18
+5V  (via drill 0.35)
  Top 0.254: v47.47,58.24 U$59.P$2 45.03,58.32 44.42,58.93 42.44,58.93 39.92,61.44 21.79,61.44 21.03,60.68 12.19,60.68 10.66,59.16 9.52,59.16 SV2.12
  Bottom 0.254: 58.06,45.06 59.66,45.06 U$23.S 59.74,45.21 60.04,45.52 60.04,45.59 62.1,47.65 65.38,47.65 U$11.VIN | U$24.P$2 58.06,45.06 | U$61.P$2 52.65,62.05 52.34,61.75 50.82,61.75 U$60.S 50.82,61.59 v47.47,58.24 47.39,58.16 57.98,47.57 57.98,45.13 58.06,45.06
+5V_OFF1
  Bottom 0.254: 49.37,61.75 49.83,61.75 U$60.DDD | 49.37,61.75 48.91,61.75 U$60.DDDD | 49.37,64.19 49.83,64.19 U$60.DD 49.83,64.34 49.83,67.16 50.67,68 X2.1 | 49.37,64.19 48.91,64.19 U$60.D | 49.37,64.19 49.37,61.75
ALL_LED  (via drill 0.35)
  Top 0.254: U$10.P$1 32.69,10.77 30.55,10.77 28.57,8.79 24.76,8.79 ST.K 24.68,8.86 19.96,13.59 18.28,13.59 v13.56,18.31 | v6.7,38.12 6.7,38.58 2.74,42.54 2.74,53.06 2.13,53.67 2.13,54.43 8.38,60.68 11.04,60.68 11.96,61.59 SV2.13 21.41,61.67 22.02,62.28 50.36,62.28 v50.74,62.66 50.82,62.58 54.1,62.58 63.24,53.44 63.24,50.85 68.19,45.9 68.19,18.69 69.11,17.78 72.61,17.78 73.22,18.39 73.22,19 74.21,19.99 75.13,19.99 75.81,19.3 75.81,14.96 71.17,10.31 71.17,9.4 U$4.P$21
  Bottom 0.254: U$4.P$21 69.95,8.18 65.22,8.18 60.34,3.3 56.76,3.3 X3.5 | U$62.G 57.14,64.19 57.14,62.81 57.75,62.2 57.75,61.21 55.93,59.38 55.32,59.38 53.49,61.21 53.49,62.97 52.73,63.73 U$61.P$1 52.34,64.19 50.82,64.19 U$60.G 50.74,64.11 v50.74,62.66 | v13.56,18.31 6.7,25.17 v6.7,38.12
BL  (via drill 0.35)
  Top 0.152: v22.7,42.01 22.7,39.8 23.16,39.34 23.92,39.34 24.76,40.18 24.99,40.18 U2.28 | v20.49,49.17 v20.49,47.04
  Bottom 0.152: v22.7,42.01 22.7,44.83 v20.49,47.04 | v20.49,49.17 20.49,51.15 26.36,57.02 26.36,58.32 26.89,58.85 29.41,58.85 42.36,45.9 42.36,37.74 55.24,24.87 55.24,21.97 58.36,18.85 58.36,16.94 62.4,12.9 62.4,10.46 63.47,9.4 U$4.P$15
BUZA  (via drill 0.35)
  Top 0.152: v13.71,39.42 15.16,39.42 16.76,37.82 16.91,37.82 U2.44 | v7.08,46.05 3.12,50.01 3.12,53.21 2.51,53.82 2.51,54.28 6.09,57.86 20.87,57.86 22.25,59.23 v41.14,59.23 | v63.93,46.96 v53.41,46.96
  Bottom 0.152: v7.08,46.05 v13.71,39.42 | v53.41,46.96 v41.14,59.23 | v63.93,46.96 64.38,46.51 69.34,46.51 70.48,47.65 U$11.DIN
BUZA_SW  (via drill 0.35)
  Top 0.152: v22.78,37.13 21.86,36.22 19.73,36.22 19.43,36.52 19.43,37.29 18.05,38.66 18.05,38.81 U2.41 | v28.34,42.85 30.32,44.83 v55.93,44.83
  Bottom 0.152: U$23.G 58.21,42.62 57.83,43 U$24.P$1 57.75,43 v55.93,44.83 | v22.78,37.13 24,37.13 28.34,41.48 v28.34,42.85
CAM_RST  (via drill 0.35)
  Top 0.152: CAM_RST.2 25.52,5.59 21.48,5.59 CAM_RST.1 21.41,5.66 21.41,7.11 16.91,11.61 16.91,13.97 v16.68,14.2 | v7.39,34.62 7.39,36.07 1.14,42.31 1.14,56.03 v9.37,64.26 | v51.43,51.15 56.84,51.15 U$1.P$16
  Bottom 0.152: v16.68,14.2 16.68,25.32 v7.39,34.62 | v9.37,64.26 38.32,64.26 v51.43,51.15
CAM_RX
  Top 0.152: U$1.P$8 56.01,19.76 CAMRX.1 CAMRX.2 41.87,19.76 30.42,31.21 29.9,31.21 U2.14
CAM_TX
  Top 0.152: U$1.P$7 56.01,22.3 CAMTX.2 CAMTX.1 39.76,22.3 30.55,31.52 30.3,31.52 U2.15
COM  (via drill 0.35)
  Top 0.152: v27.66,30.5 27.2,30.5 26.59,31.11 26.44,31.11 U2.9 | v44.12,20.83 56.38,20.83 58.36,18.85 58.36,17.86 v59.89,16.33
  Bottom 0.152: v27.66,30.5 27.66,31.65 29.64,33.63 31.31,33.63 v44.12,20.83 | v59.89,16.33 59.89,15.87 63.47,12.29 63.47,11.91 U$4.P$16
CS  (via drill 0.35)
  Top 0.152: v24.45,38.89 24.91,38.89 25.52,39.5 25.67,39.5 U2.26 | v26.05,41.55 29.94,45.44 v35.96,45.44
  Bottom 0.152: v24.45,38.89 24.45,39.95 v26.05,41.55 | v35.96,45.44 37.79,43.61 37.79,41.86 52.73,26.92 52.73,14.58 53.72,13.59 56.69,13.59 58.36,11.91 U$4.P$12
DC  (via drill 0.35)
  Top 0.152: v33.37,41.86 33.22,42.01 27.05,42.01 26.66,41.63 26.66,41.25 25.37,39.95 U2.27 | v44.5,23.57 v44.5,26.77
  Bottom 0.152: v33.37,41.86 33.37,37.9 v44.5,26.77 | v44.5,23.57 44.5,22.58 49.68,17.4 49.68,15.26 51.96,12.98 53.79,12.98 54.78,11.99 54.78,11.45 55.77,10.46 59.89,10.46 60.95,9.4 U$4.P$13
ESP_RX  (via drill 0.35)
  Top 0.152: X3.4 56,4.55 56,7.04 | v37.33,23.44 37.99,22.78 37.99,9.52 39.54,7.97 41.73,7.97 42.05,8.29 51.23,8.29 51.27,8.33 52.7,8.33 53.97,7.06 ESP_RX.2 54.48,7.04 56,7.04 | v30.03,32.65 29.04,33.63 U2.16 | 56,7.04 ESP_RX.1
  Bottom 0.152: v37.33,23.44 37.33,25.34 v30.03,32.65
ESP_TX  (via drill 0.35)
  Top 0.152: X3.3 52.7,6.55 ESPTX.1 ESPTX.2 v46.35,7.06 | U2.17 28.89,34.68 v31.08,32.49
  Bottom 0.152: v31.08,32.49 37.99,25.58 37.99,9.52 40.3,7.21 46.2,7.21 v46.35,7.06
F_LED  (via drill 0.35)
  Top 0.152: Q2.2 43.43,58.09 U$58.P$1 43.43,56.56 42.74,56.56 38.55,52.37 32,52.37 v27.35,47.73 | v25.98,47.5 25.98,47.04 22.09,43.15 22.09,38.73 23.39,37.44 23.39,36.83 22.47,35.91 19.66,35.91 18.43,34.7 17.29,34.7 15.92,33.32 U2.50
  Bottom 0.152: v27.35,47.73 26.21,47.73 v25.98,47.5
GND  (via drill 0.35)
  Top 0.254: CAM_RST.4 25.52,3.45 21.48,3.45 CAM_RST.3 21.33,3.53 17.9,3.53 16.45,4.98 10.82,4.98 v10.13,5.66 9.14,5.66 RESET.2 8.99,5.59 4.95,5.59 RESET.1 | U2.12 27.5,32.18 31.85,27.84 31.85,24.41 31.09,23.65 31.09,22.05 31.39,21.74 31.39,21.59 30.17,20.37 29.26,20.37 U$30.P$2 U$31.P$2 28.04,19.38 24.23,23.19 v24.15,23.19 | 11.96,36.3 11.12,36.3 U$37.P$2 | 12.95,37.29 11.96,36.3 | 12.95,37.29 15.31,37.29 15.84,36.75 U2.47 | v19.5,24.79 20.42,23.88 20.95,23.88 U$38.P$2 | v18.28,26.01 18.97,26.69 U$40.P$1 19.12,26.85 19.12,27.3 20.49,28.68 U2.63 | v12.04,33.32 12.04,36.22 11.96,36.3 | U$25.P$2 15.84,51.46 14.7,50.32 6.09,50.32 5.02,49.25 5.02,48.72 5.48,48.26 5.86,48.26 9.75,44.37 9.75,43.91 U$35.P$2 9.9,43.84 v9.9,41.17 | 29.79,36.98 29.79,36.6 29.26,36.07 29.26,35.46 31.77,32.94 31.77,31.95 U$36.P$2 | 29.79,36.98 29.48,37.29 29.1,37.29 28.57,36.75 U2.18 | v32.69,38.96 31.85,38.12 U$2.P$2 | v30.09,37.06 29.87,37.06 29.79,36.98 | U$7.P$2 23.24,55.34 24.99,55.34 U$39.P$2 | SV1.3 24.76,55.42 U$39.P$2 | 23.39,45.36 23.92,45.9 U$32.P$2 | 23.39,45.36 22.86,44.83 22.86,44.6 U$33.P$2 | 26.59,47.12 26.66,47.19 26.66,47.8 26.28,48.18 26.05,48.18 | 26.59,47.12 24.61,45.13 24.61,43.99 24.99,43.61 24.99,42.47 24,41.48 24,41.33 U2.31 | 26.05,48.18 23.85,48.18 22.55,46.89 22.55,46.2 23.39,45.36 | 26.05,48.18 26.05,50.39 25.14,51.31 25.14,55.27 U$39.P$2 | v29.79,47.04 26.66,47.04 26.59,47.12 | v12.87,38.2 12.87,37.36 12.95,37.29 | X3.2 50.74,3.23 51.12,2.84 51.12,2.01 U$34.P$2 51.28,1.93 62.55,1.93 66.75,6.12 68.58,6.12 71.17,3.53 71.17,3.3 X1.2 | SV2.14 10.59,61.67 11.58,62.66 20.57,62.66 20.87,62.36 21.48,62.36 22.78,63.65 50.29,63.65 54.63,68 X2.3
  Bottom 0.254: 12.11,5.66 12.11,6.2 12.95,7.04 U$5.P$2 13.02,7.11 13.02,8.25 16,11.23 17.37,11.23 22.02,15.87 22.02,23.19 | 12.11,5.66 12.11,5.43 U$6.P$2 | v10.13,5.66 12.11,5.66 | v12.04,33.32 16.07,29.29 16.07,27.23 17.22,26.09 18.21,26.09 v18.28,26.01 v19.5,24.79 21.1,23.19 22.02,23.19 | 22.02,23.19 v24.15,23.19 | SV2.14 9.52,60.6 10.59,59.54 | 10.59,59.54 10.74,59.38 10.74,56.49 12.19,55.04 12.49,55.04 15.84,51.69 15.84,51.53 U$25.P$2 | v30.09,37.06 30.78,37.06 v32.69,38.96 32.69,42.92 U$3.P$2 33.22,43.61 v29.79,47.04 | 10.59,59.54 11.5,60.45 20.72,60.45 22.32,58.85 23.77,58.85 SV1.3 | v9.9,41.17 v12.87,38.2 | X1.2 71.24,3.3 72.23,4.29 72.23,9.85 71.17,10.92 71.17,11.84 U$4.P$22 71.17,11.99 71.17,13.82 75.81,18.46 75.81,31.65 73.6,33.86 73.6,38.43 74.21,39.04 74.21,46.51 U$11.GND2 72.16,48.56 | 69.49,48.95 68.27,47.73 67.97,47.73 U$11.GND | 69.49,48.95 71.78,48.95 72.16,48.56 | 69.49,48.95 68.5,49.94 68.5,53.97 54.71,67.77 54.71,68 X2.3 | 72.16,48.56 74.67,51.08 U$1.P$9
  other vias: 64.13,24.84 28.57,4.52 23.49,13.41 19.68,21.03 12.06,14.68 8.25,17.22 4.44,15.95 6.98,4.52 18.41,4.52 43.81,3.25 62.86,3.25 61.59,7.06 75.56,5.79 66.67,15.95 78.1,15.95 73.02,26.11 64.13,35 61.59,40.08 76.83,43.89 64.13,45.16 60.32,48.97 75.56,57.86 61.59,59.13 43.81,65.48 33.65,66.75 36.19,56.59 38.73,47.7 29.84,55.32 14.6,54.05 13.33,68.02 3.17,60.4 6.98,48.97 6.98,42.62 12.06,42.62 8.25,31.19 9.52,26.11 26.03,52.78 27.3,46.43 22.22,32.46 28.57,22.3 43.81,47.7 50.16,40.08 55.24,35 51.43,31.19
  pour Top: -5.72,70.56 -5.72,-5.64 86.99,-5.64 86.99,70.56
  pour Bottom: -5.72,70.56 -5.72,-5.64 88.26,-5.64 88.26,70.56
IR_RST  (via drill 0.35)
  Top 0.152: v50.06,4.29 48.99,5.36 46.33,5.36 46.17,5.21 42.52,5.21 41.37,6.35 38.86,6.35 35.35,2.84 4.26,2.84 4.11,3 4.11,6.04 5.41,7.34 5.41,11.53 3.53,13.41 3.53,28.22 12.26,28.22 U2.52
  Bottom 0.152: v50.06,4.29 54.94,4.29 55.77,3.45 55.77,2.92 56.38,2.31 64.23,2.31 65.15,3.23 X1.5
IR_RX  (via drill 0.35)
  Top 0.152: U2.53 17.81,33.07 20.34,33.07 v20.95,32.46 | v46.51,4.68 47.82,3.36 47.82,2.29 49.02,1.09 67.05,1.09 68.32,2.36 v68.32,5.41
  Bottom 0.152: X1.4 67.21,5.76 IR_RX.1 IR_RX.2 68.32,6.17 v68.32,5.41 | v20.95,32.46 20.95,31.62 31.24,21.33 31.24,15.82 40.25,6.81 44.38,6.81 v46.51,4.68
IR_TX  (via drill 0.35)
  Top 0.152: U2.54 17.91,32.46 v19.68,32.46
  Bottom 0.152: v19.68,32.46 30.94,21.2 30.94,15.64 40.12,6.45 43.87,6.45 48.35,1.98 69.06,1.98 70.33,3.25 70.33,3.61 71.24,4.52 IR_TX.2 IR_TX.1 69.72,3.76 X1.3
JYRO_LED  (via drill 0.35)
  Top 0.152: v18.43,35.61 16.68,37.36 U2.45 | v22.02,24.71 22.02,20.75 18.89,17.63 18.89,17.17 21.25,14.81 31.77,14.81 39.24,7.34 44.72,7.34 46.4,5.66 49.6,5.66 51.81,3.45 51.81,2.84 52.34,2.31 55.01,2.31 55.77,3.07 55.77,3.83 56.84,4.9 56.84,7.95 56.53,8.25 55.47,8.25 54.4,9.32 54.4,9.78 53.72,10.46 51.89,10.46 50.82,9.4 U$4.P$5
  Bottom 0.152: v18.43,35.61 18.43,32.33 20.64,30.12 20.64,26.09 v22.02,24.71
JYRO_RST  (via drill 0.35)
  Top 0.152: JYRO.3 12.57,3.45 12.72,3.61 v13.64,3.61 13.79,3.45 16.61,3.45 JYRO.4 | v15.23,41.02 15.62,41.02 16.61,40.03 17.37,40.03 18.13,39.27 18.36,39.27 U2.40 | v32.99,35.99 29.64,39.34 v29.64,40.33 | v25.06,47.04 23.69,47.04 v23.24,46.58 | v18.89,48.56 18.89,47.42 17.75,46.28 17.75,44.37 v16.38,43
  Bottom 0.152: U$6.P$1 12.11,3.61 v13.64,3.61 18.66,8.64 20.34,8.64 24.76,13.05 24.76,23.49 24.45,23.8 23.85,23.8 23.69,23.65 21.56,23.65 19.88,25.32 19.88,29.82 15.23,34.47 v15.23,41.02 16.38,42.16 v16.38,43 | v32.99,35.99 32.99,33.63 46.78,19.84 46.78,11.84 48.23,10.39 48.23,9.4 U$4.P$3 | v29.64,40.33 29.64,42.47 v25.06,47.04 | v23.24,46.58 21.25,48.56 v18.89,48.56
L_SW  (via drill 0.35)
  Top 0.152: v31.77,23.34 31.77,21.44 28.8,18.46 27.96,18.46 23.54,22.88 23.54,23.49 25.9,25.86 25.9,28.45 25.6,28.75 25.45,28.75 24.84,29.36 24.68,29.36 U2.4
  Bottom 0.152: v31.77,23.34 31.77,29.97 29.41,32.33 29.41,32.94 29.79,33.32 31.16,33.32 40.46,24.03 40.46,15.64 45.64,10.46 46.63,10.46 47.16,9.93 47.16,8.94 47.85,8.25 51.2,8.25 52.27,9.32 52.27,9.78 52.95,10.46 54.78,10.46 55.85,9.4 U$4.P$9
LCD_RST  (via drill 0.35)
  Top 0.152: v25.98,35.53 25.98,35.3 25.06,34.39 17.9,34.39 16.45,32.94 16.3,32.94 U2.51
  Bottom 0.152: v25.98,35.53 26.66,34.85 26.66,34.77 27.05,34.39 29.03,34.39 29.79,35.15 30.78,35.15 32.53,36.91 33.45,36.91 50.29,20.06 50.29,16.56 53.56,13.28 56,13.28 57.3,11.99 57.3,11.45 57.98,10.77 59.89,10.77 60.95,11.84 U$4.P$14
LED_1  (via drill 0.35)
  Top 0.152: v13.02,29.89 4.36,29.89 LED1.A | v14.7,29.67 16.15,29.67 17.06,30.58 17.45,30.58 17.98,31.11 U2.56
  Bottom 0.152: v13.02,29.89 14.47,29.89 v14.7,29.67
LED_2
  Top 0.152: LED2.A 14.32,27.38 17.22,30.28 17.9,30.28 18.36,30.73 U2.57
LED_3
  Top 0.152: LED3.A 4.36,24.87 12.04,24.87 14.09,26.92 17.45,26.92 19.73,29.21 19.73,29.36 U2.61
LED_4
  Top 0.152: LED4.A 4.36,22.35 9.98,22.35 14.24,26.62 17.75,26.62 20.11,28.98 U2.62
LED_5  (via drill 0.35)
  Top 0.152: LED5.A 7.84,19.76 13.48,25.4 18.59,25.4 20.95,27.76 v21.25,27.76 | v20.04,36.83 21.41,38.2 21.41,41.1 20.87,41.63 U2.33
  Bottom 0.152: v21.25,27.76 21.25,29.97 19.05,32.18 19.05,35.84 v20.04,36.83
MISO  (via drill 0.35)
  Top 0.152: v25.6,37.67 25.67,37.59 26.51,37.59 27.05,38.12 U2.22 | v28.72,40.11 28.72,40.33 29.33,40.94 33.22,40.94 v33.98,40.18 | v41.68,31.19 41.68,30.88 40.76,29.97 MISO.1 40.76,29.89 39.24,29.89 MISO.2
  Bottom 0.152: v25.6,37.67 26.28,37.67 v28.72,40.11 | v33.98,40.18 33.98,38.89 v41.68,31.19
MOSI  (via drill 0.35)
  Top 0.152: v34.82,34.16 33.9,34.16 32.38,35.69 32.38,36.14 29.48,39.04 27.5,39.04 26.97,38.51 26.82,38.51 U2.23 | 39.24,32.48 v36.49,32.48 | 39.24,32.48 40.76,32.48 MOSI.2 40.76,32.41 41.37,32.41 50.13,23.65 v51.51,23.65 | 39.24,32.48 MOSI.1 | v52.12,18.39 55.85,14.66 55.85,11.91 U$4.P$10
  Bottom 0.152: v36.49,32.48 v34.82,34.16 | v52.12,18.39 52.12,23.04 v51.51,23.65
MVLED_1
  Top 0.152: MV1.A 71.75,53.32 70.61,52.19 70.61,19.89 U$1.P$3
MVLED_2  (via drill 0.35)
  Top 0.152: U$1.P$2 71.75,19.26 71.75,50.08 71.12,50.71 71.12,52.26 72.06,53.2 72.06,61.37 v72.36,61.67 | v69.21,64.21 MV2.A
  Bottom 0.152: v72.36,61.67 74.29,63.6 74.29,64.41 73.22,65.48 70.28,65.48 69.74,64.94 69.74,64.74 v69.21,64.21
MVLED_3
  Top 0.152: MV3.A 69.6,62.82 U$1.P$11
MVLED_4
  Top 0.152: MV4.A 67.06,62.82 U$1.P$12
MVLED_5
  Top 0.152: MV5.A 64.52,62.82 U$1.P$13
N$1
  Bottom 0.152: U$62.DDDD 55.24,61.75 56.15,61.75 U$62.DDD 56.15,61.82 56.15,64.11 U$62.DD 56.15,64.19 55.24,64.19 U$62.D 55.24,65.48 X2.2
N$2
  Bottom 0.305: U$12.P$1 58.94,33.62 U$11.VO1
N$3
  Bottom 0.305: U$11.VO2 U$12.P$2
N$6
  Bottom 0.152: U$23.D U$23.DD | 61.56,45.13 U$23.DDDD | U$11.EN2 73,40.11 70.48,40.11 U$11.EN1
  Bottom 0.305: 70.48,40.11 67.97,42.62 U$23.D U$23.DD | U$11.EN1 U$11.EN2 | 61.56,45.13 60.66,45.13 U$23.DDD U$23.DD
N$17
  Top 0.152: ST.A U$9.P$2
N$19  (via drill 0.35)
  Top 0.152: v58.9,64.57 51.73,64.57 50.13,62.97 v25.67,62.97
  Bottom 0.152: U$17.P$2 73,64.64 70.48,64.64 U$16.P$2 70.48,64.57 69.49,63.58 68.96,63.58 U$15.P$2 67.89,64.64 65.45,64.64 U$14.P$2 65.38,64.64 62.86,64.64 U$13.P$2 62.86,64.57 v58.9,64.57 | U$10.P$3 19.27,8.33 13.94,3 11.58,3 5.41,9.17 5.41,20.9 5.33,20.98 U$18.P$2 U$19.P$2 U$20.P$2 U$21.P$2 U$22.P$2 6.32,32.18 6.32,36.14 1.14,41.33 1.14,57.1 7.69,63.65 24.53,63.65 25.22,62.97 v25.67,62.97
N$20  (via drill 0.35)
  Top 0.152: LED1.K v1.4,29.92
  Bottom 0.152: v1.4,29.92 U$22.P$1
N$21  (via drill 0.35)
  Top 0.152: v1.4,27.38 LED2.K
  Bottom 0.152: U$21.P$1 v1.4,27.38
N$22  (via drill 0.35)
  Top 0.152: v1.4,24.84 LED3.K
  Bottom 0.152: U$20.P$1 v1.4,24.84
N$23  (via drill 0.35)
  Top 0.152: v1.4,22.3 LED4.K
  Bottom 0.152: U$19.P$1 v1.4,22.3
N$24  (via drill 0.35)
  Top 0.152: v1.4,19.76 LED5.K
  Bottom 0.152: U$18.P$1 v1.4,19.76
N$25  (via drill 0.35)
  Top 0.152: MV5.K v61.59,68.6
  Bottom 0.152: v61.59,68.6 U$13.P$1
N$26  (via drill 0.35)
  Top 0.152: MV4.K v64.13,68.6
  Bottom 0.152: v64.13,68.6 U$14.P$1
N$27  (via drill 0.35)
  Top 0.152: MV3.K v66.67,68.6
  Bottom 0.152: v66.67,68.6 U$15.P$1
N$28  (via drill 0.35)
  Top 0.152: MV2.K v69.21,68.6
  Bottom 0.152: v69.21,68.6 U$16.P$1
N$29  (via drill 0.35)
  Top 0.152: MV1.K v71.75,68.6
  Bottom 0.152: v71.75,68.6 U$17.P$1
N$40
  Top 0.152: U$30.P$1 30.48,21.74 30.48,24.26 29.03,25.7 U$29.P$1 28.95,25.78 28.95,26.47 25.37,30.05 U2.6
N$41  (via drill 0.35)
  Top 0.152: 26.21,17.86 22.86,17.86 22.02,18.69 U$29.P$2 | 26.21,17.86 26.59,17.86 U$31.P$1 26.21,17.86 | v26.21,22.2 26.21,28.6 25.06,29.74 U2.5 | 26.21,17.86 v26.21,18.77
  Bottom 0.152: v26.21,18.77 v26.21,22.2
N$42  (via drill 0.35)
  Top 0.152: v55.62,60.07 45.11,60.07 U$59.P$1 45.03,60.07 42.59,60.07 Q2.3
  Bottom 0.152: v55.62,60.07 57.07,61.52 57.07,61.67 U$62.S
N$43
  Top 0.152: U$32.P$1 25.52,44.3 25.52,42.24 24.3,41.02 U2.30
N$44
  Top 0.152: U$40.P$2 17.83,28.07 19.5,29.74 U2.60
R_SW  (via drill 0.35)
  Top 0.152: v49.52,6.43 46.1,6.43 44.88,7.64 39.39,7.64 31.92,15.11 21.41,15.11 19.2,17.32 19.2,17.47 22.63,20.9 22.63,25.17 24.45,27 24.45,27.99 24,28.45 24,28.68 U2.2
  Bottom 0.152: v49.52,6.43 50.44,6.43 53.34,9.32 U$4.P$7
RESET  (via drill 0.35)
  Top 0.152: U$39.P$1 27.05,55.34 27.05,57.63 27.27,57.86 SV1.5 | RESET.3 4.95,3.45 8.99,3.45 RESET.4 9.06,3.45 10.36,3.45 v11.2,4.29 | 25.14,31.34 25.14,31.8 v25.6,32.26 | 25.14,31.34 25.14,31.19 25.67,30.66 25.67,30.5 U2.7 | v23.24,22.27 23.24,25.32 25.29,27.38 v25.29,28.14 | 25.14,31.34 v24.68,31.34 | v50.9,17.09 45.72,11.91 U$4.P$2
  Bottom 0.152: v25.6,32.26 27.81,32.26 29.48,33.93 31.92,33.93 45.72,20.14 U$4.P$2 | v11.2,4.29 12.04,4.29 18.36,10.62 18.36,11.68 23.24,16.56 v23.24,22.27 | v25.29,28.14 25.29,30.73 v24.68,31.34 | v50.9,17.09 50.9,28.29 50.59,28.6 50.13,28.6 35.28,43.46 35.28,44.07 34.28,45.06 34.28,46.12 27.35,53.06 27.35,57.86 SV1.5
RESET_LED  (via drill 0.35)
  Top 0.152: v29.18,37.97 28.42,37.97 27.88,37.44 U2.20 | v30.78,36.37 44.19,22.96 v45.94,22.96 | v50.29,15.57 50.29,13.89 48.31,11.91 U$4.P$4
  Bottom 0.152: v29.18,37.97 29.18,37.06 29.87,36.37 v30.78,36.37 | v45.94,22.96 49.98,18.92 49.98,15.87 v50.29,15.57
RST_1  (via drill 0.35)
  Top 0.152: v19.66,43 19.66,42.31 20.49,41.48 20.49,41.33 U2.34 | v18.05,47.57 18.05,48.64 18.59,49.17 v18.59,50.62
  Bottom 0.152: v19.66,43 19.66,43.46 18.05,45.06 v18.05,47.57 | v18.59,50.62 18.59,57.71 16.23,60.07 11.65,60.07 11.12,59.54 11.12,57.55 12.04,56.64 SV2.9
RST_2
  Top 0.152: U2.35 20.11,41.02 20.11,41.17 19.05,42.24 19.05,44.3 23.77,49.02 23.77,49.63 17.75,55.65 10.43,55.65 9.52,56.56 SV2.10
RST_3  (via drill 0.35)
  Top 0.152: v17.98,51.69 18.43,51.69 19.5,50.62 19.5,47.57 18.74,46.81 18.74,41.78 19.73,40.79 19.73,40.64 U2.36
  Bottom 0.152: v17.98,51.69 17.98,57.86 16.76,59.08 12.11,59.08 SV2.11
RX_1  (via drill 0.35)
  Top 0.152: U2.42 15.77,40.38 5.84,40.38 5.33,40.89 5.33,42.75 3.8,44.27 v3.55,44.27
  Bottom 0.152: v3.55,44.27 3.17,44.65 RX1.2 RX1.1 4,47.19 4.81,48.01 8.55,48.01 SV2.4
RX_2  (via drill 0.35)
  Top 0.152: U2.37 18.34,41.35 17.14,41.35 v13.33,45.16
  Bottom 0.152: SV2.6 8.76,52.27 RX2.2 RX2.1 6.55,49.91 12.45,49.91 13.36,49 13.33,48.97 v13.33,45.16
RX_3  (via drill 0.35)
  Top 0.152: U2.29 24.03,39.99 v23.41,39.99
  Bottom 0.152: SV2.8 8.12,55.45 8.12,55.83 6.6,57.35 RX3.2 RX3.1 6.34,55.83 9.39,52.78 12.94,52.78 14.99,50.73 15.81,50.73 18.71,47.83 18.71,44.86 23.41,40.16 v23.41,39.99
S0  (via drill 0.35)
  Top 0.152: v26.59,33.25 26.21,32.87 26.21,32.26 26.74,31.72 26.74,31.57 U2.10 | v49.37,18.62 50.52,18.62 53.95,15.19 53.95,14.05 52.27,12.37 52.27,11.45 52.95,10.77 56,10.77 57.3,9.47 57.3,8.86 v61.11,5.05
  Bottom 0.152: v26.59,33.25 28.34,33.25 29.94,34.85 30.93,34.85 32.69,36.6 33.29,36.6 45.33,24.56 45.33,22.66 v49.37,18.62 | v61.11,5.05 61.56,5.05 65.83,9.32 65.98,9.32 U$4.P$17
S1  (via drill 0.35)
  Top 0.152: v28.27,29.82 28.27,30.81 27.27,31.8 27.12,31.8 U2.11 | v31.77,39.19 32,39.19 32.38,39.57 40,39.57 51.28,28.29 52.42,28.29 60.95,19.76 60.95,16.94 65.98,11.91 U$4.P$18
  Bottom 0.152: v28.27,29.82 27.12,29.82 24.45,32.48 24.45,35.61 26.21,37.36 27.66,37.36 29.48,39.19 v31.77,39.19
S2
  Top 0.152: U2.24 26.44,38.89 26.59,38.89 28.95,41.25 38.78,41.25 51.43,28.6 53.72,28.6 63.47,18.85 63.47,15.95 67.51,11.91 67.51,10.46 68.58,9.4 U$4.P$19
S3  (via drill 0.35)
  Top 0.152: v19.73,38.66 18.89,39.5 18.74,39.5 U2.39 | v50.29,27.99 51.81,27.99 v55.85,23.95
  Bottom 0.152: v19.73,38.66 22.93,38.66 24.07,39.8 24.07,46.66 22.4,48.34 21.94,48.34 21.56,48.72 21.56,49.17 23.08,50.7 29.26,50.7 33.98,45.97 33.98,44.91 34.97,43.91 34.97,43.31 v50.29,27.99 | v55.85,23.95 60.95,18.85 60.95,18.39 66.36,12.98 67.51,12.98 68.58,11.91 U$4.P$20
S_SW  (via drill 0.35)
  Top 0.152: v26.89,36.45 26.89,35.53 23.77,32.41 23.77,29.74 24.23,29.29 24.23,29.06 U2.3 | v29.94,35.76 29.94,35.3 41.07,24.18 v41.07,22.96 | v44.88,19.15 48.99,19.15 49.07,19.23 50.36,19.23 54.25,15.34 54.25,12.83 53.34,11.91 U$4.P$8
  Bottom 0.152: v26.89,36.45 29.26,36.45 v29.94,35.76 | v44.88,19.15 v41.07,22.96
SCK
  Top 0.152: U2.21 27.5,37.82 27.66,37.82 28.42,38.58 29.48,38.58 32.08,35.99 32.08,35.53 34.06,33.55 43.81,33.55 54.02,23.34 56.46,23.34 60.5,19.3 60.5,12.98 59.51,11.99 59.51,10.46 58.44,9.4 U$4.P$11
SCL  (via drill 0.35)
  Top 0.152: v16.76,28.9 17.14,28.9 18.66,30.43 U2.58 | v6.24,54.66 9.14,57.55 17.9,57.55 v25.37,50.09 | v34.89,46.05 v32.99,46.05
  Bottom 0.152: v16.76,28.9 16.76,30.88 9.14,38.51 7.23,38.51 1.44,44.3 1.44,52.3 2.59,53.44 5.02,53.44 v6.24,54.66 | v25.37,50.09 28.95,50.09 v32.99,46.05 | v34.89,46.05 34.89,45.21 36.19,43.91 U$3.P$3
SDA  (via drill 0.35)
  Top 0.152: v16.76,27.53 16.76,27.76 19.05,30.05 U2.59 | v16.23,45.06 17.45,46.28 17.45,48.95 v17.98,49.48 | v42.97,43 41.68,43 41.6,42.92 39.7,42.92 U$3.P$4
  Bottom 0.152: v16.76,27.53 16.76,27.99 17.37,28.6 17.37,31.88 14.93,34.31 14.93,40.41 14.62,40.72 14.62,43.46 v16.23,45.06 | v17.98,49.48 18.36,49.48 26.05,57.17 26.05,58.47 26.74,59.16 29.56,59.16 42.9,45.82 42.9,43.08 v42.97,43
ST  (via drill 0.35)
  Top 0.152: v18.59,14.27 24.76,14.27 | v29.1,27.76 26.13,30.73 U2.8 | v31.92,18.31 29.1,18.31 26.97,16.18 v21.33,16.18 | v53.34,14.88 50.82,12.37 50.82,11.91 U$4.P$6 | v61.11,13.28 62.4,11.99 62.4,11.45 63.39,10.46 63.93,10.46 64.92,9.47 64.92,8.94 67.36,6.5 69.26,6.5 72.16,3.61 72.16,2.92 v71.24,2.01 | v42.82,5.82 42.36,5.82 41.14,7.04 37.79,7.04 30.55,14.27 24.76,14.27 | 24.76,14.27 U$9.P$1 | U$8.P$2 11.88,9.62 11.88,12.29 U$8.P$5
  Bottom 0.152: U$5.P$1 11.2,7.11 11.2,8.94 11.81,9.55 U$8.P$2 | U$8.P$5 11.88,12.37 12.8,13.28 16.68,13.28 17.67,14.27 v18.59,14.27 20.49,16.18 v21.33,16.18 | v29.1,27.76 29.1,23.95 31.92,21.13 v31.92,18.31 | v53.34,14.88 59.51,14.88 v61.11,13.28 | v71.24,2.01 69.57,2.01 69.19,1.62 47.01,1.62 v42.82,5.82
SWO  (via drill 0.35)
  Top 0.152: v15.84,30.88 16.99,30.88 17.6,31.5 U2.55 | v9.21,37.52 6.4,37.52 1.44,42.47 1.44,55.88 8.61,63.04 v21.18,63.04
  Bottom 0.152: v9.21,37.52 v15.84,30.88 | v21.18,63.04 24.68,63.04 27.27,60.45 SV1.6
TCK  (via drill 0.35)
  Top 0.152: v14.32,34.92 15.54,33.7 U2.49 | v17.22,50.7 v14.32,47.8 | v16.45,58.47 20.26,58.47 22.17,60.38 SV1.2
  Bottom 0.152: v14.32,47.8 v14.32,34.92 | v17.22,50.7 17.22,57.71 v16.45,58.47
TMS  (via drill 0.35)
  Top 0.152: v9.75,38.81 14.4,38.81 16.07,37.13 16.23,37.13 U2.46 | v2.05,49.71 2.05,53.21 1.75,53.52 1.75,55.27 v8.23,61.75
  Bottom 0.152: v9.75,38.81 7.39,38.81 2.05,44.14 v2.05,49.71 | v8.23,61.75 9.14,62.66 20.64,62.66 21.94,61.36 23.85,61.36 24.76,60.45 SV1.4
TX_1  (via drill 0.35)
  Top 0.152: U2.43 15.37,40.08 5.71,40.08 4.44,41.35 v4.44,42.62
  Bottom 0.152: v4.44,42.62 4.44,44.4 TX1.1 TX1.2 6.22,47.7 10.79,47.7 SV2.3
TX_2  (via drill 0.35)
  Top 0.152: v5.71,48.97 6.98,47.7 9.58,47.7 11.12,46.16 11.12,46.04 16.76,40.4 18.41,40.4 18.9,39.9 U2.38
  Bottom 0.152: v5.71,48.97 4.95,48.97 TX2.2 3.2,50.77 3.2,52.22 TX2.1 4,52.27 4.81,53.09 8.63,53.09 9.27,52.45 11.12,52.45 SV2.5
TX_3  (via drill 0.35)
  Top 0.152: v3.17,54.05 6.98,54.05 8.25,52.78 18.41,52.78 v22.22,48.97 | v27.3,41.35 27.3,40.43 U2.25
  Bottom 0.152: SV2.7 10.54,55.57 8.52,55.57 8.52,56.38 6.73,58.16 4.81,58.16 4,57.35 TX3.1 TX3.2 v3.17,54.05 | v22.22,48.97 27.3,43.89 v27.3,41.35

### Text on the board
tPlace: START | ON | LED | OFF